# EAGLE design SparkFun_MicroMod_Function_ADIN1110 (EAGLE 9.6.2)
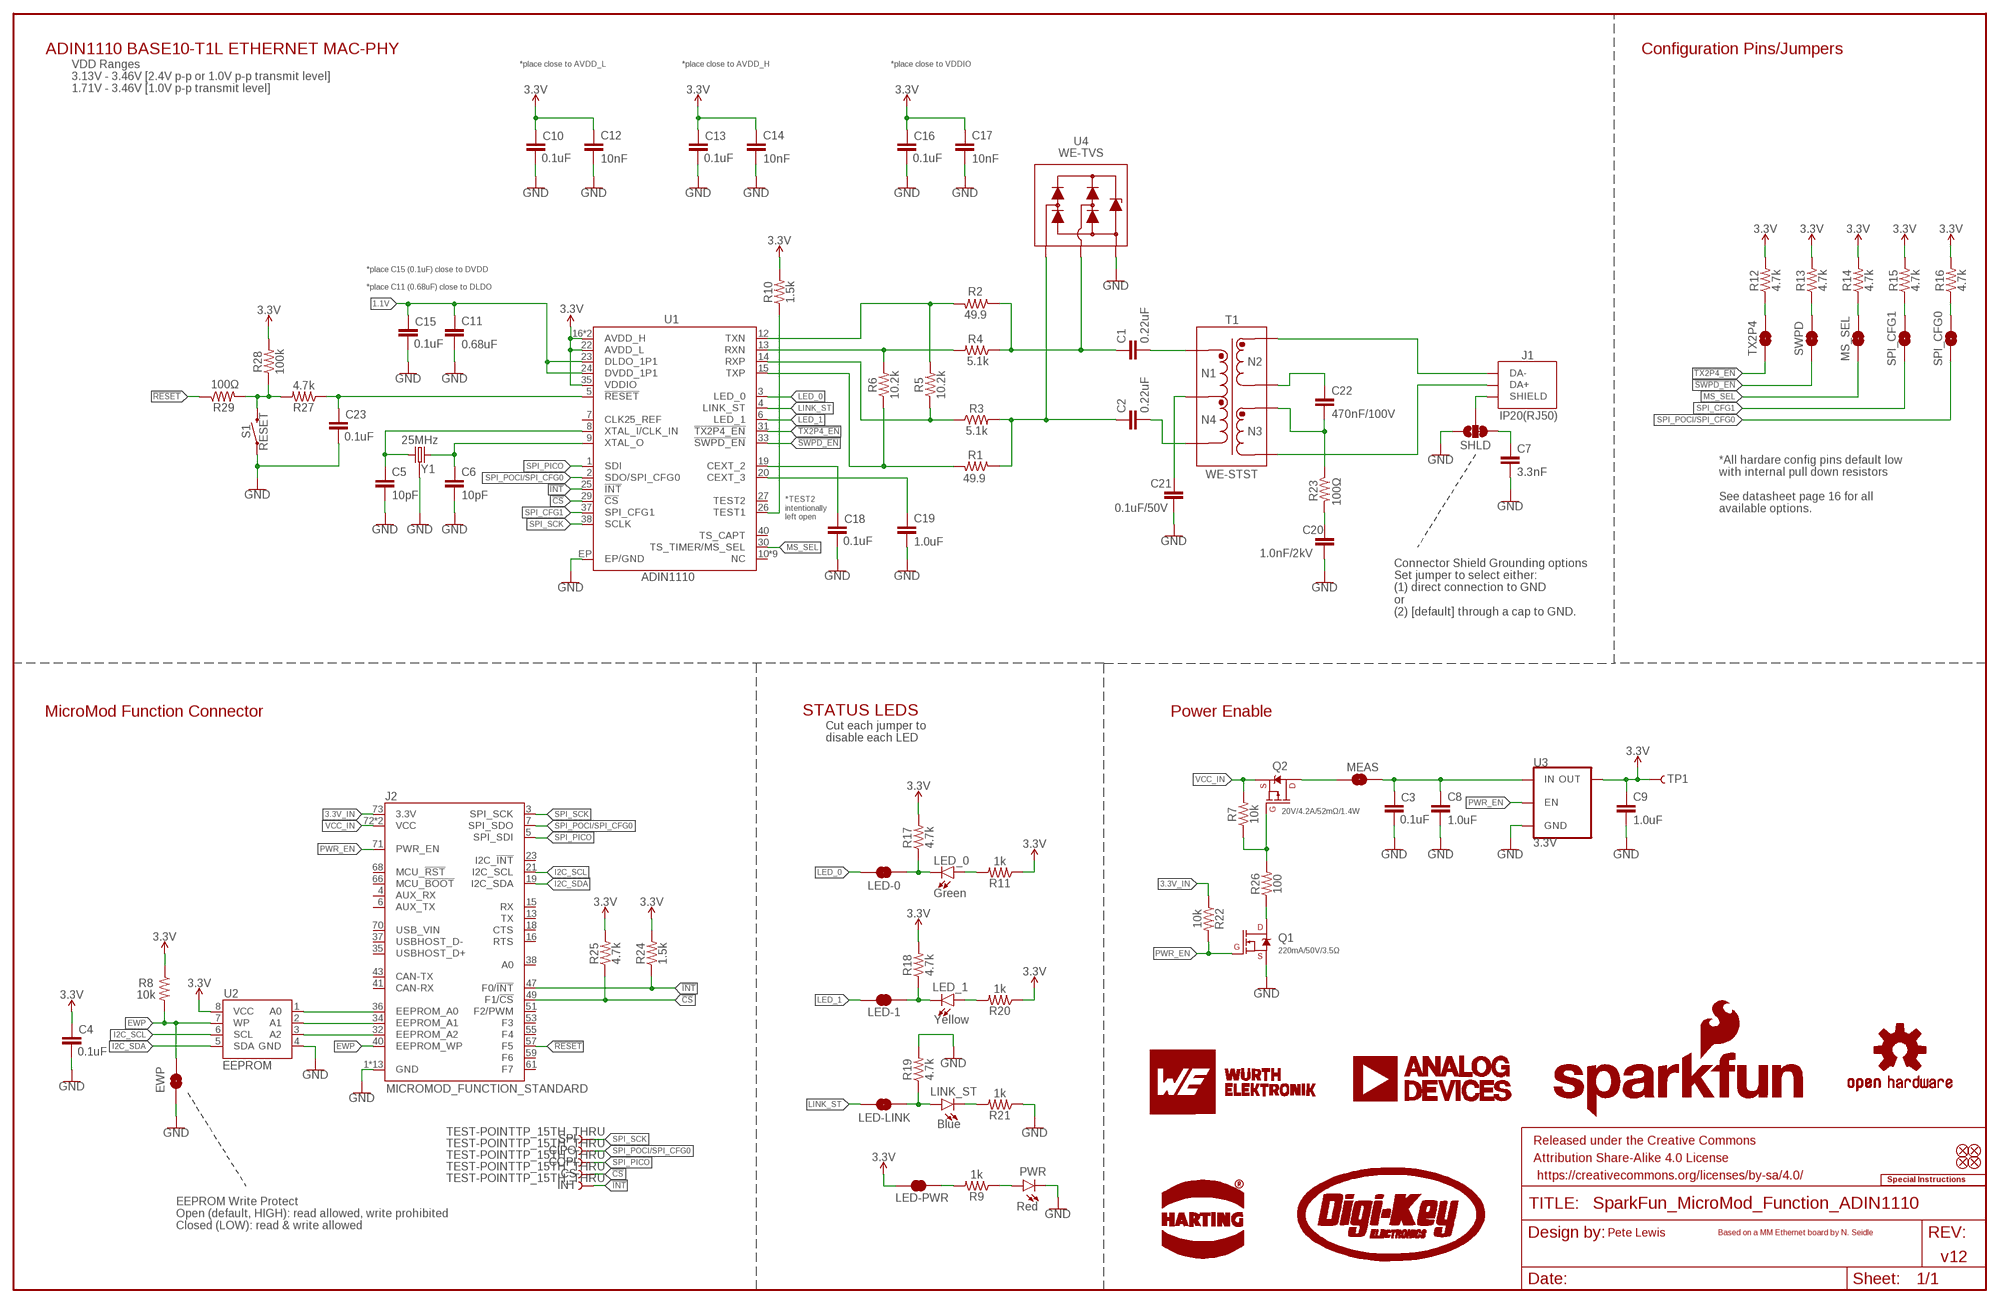
[diagram p0: schematic, sheet 1]

## Parts
C1  0.22uF  0.22UF-0603-50V-10%  [0603]
C2  0.22uF  0.22UF-0603-50V-10%  [0603]
C3  0.1uF  0.1UF-0603-25V-10%-X7R-WE  [0603]
C4  0.1uF  0.1UF-0603-25V-10%-X7R-WE  [0603]
C5  10pF  10PF-0603-50V-5%-C0G-WE  [0603]
C6  10pF  10PF-0603-50V-5%-C0G-WE  [0603]
C7  3.3nF  3.3NF-0603-100V-10%-WE  [0603]
C8  1.0uF  1.0UF-0603-16V-10%-X7R-WE  [0603]
C9  1.0uF  1.0UF-0603-16V-10%-X7R-WE  [0603]
C10  0.1uF  0.1UF-0402T-16V-10%-X7R-WE  [0402-TIGHT]
C11  0.68uF  0.68UF-0603-16V-10%-X7R-WE  [0603]
C12  10nF  10NF-0402T-25V-10%-X7R-WE  [0402-TIGHT]
C13  0.1uF  0.1UF-0402T-16V-10%-X7R-WE  [0402-TIGHT]
C14  10nF  10NF-0402T-25V-10%-X7R-WE  [0402-TIGHT]
C15  0.1uF  0.1UF-0402T-16V-10%-X7R-WE  [0402-TIGHT]
C16  0.1uF  0.1UF-0402T-16V-10%-X7R-WE  [0402-TIGHT]
C17  10nF  10NF-0402T-25V-10%-X7R-WE  [0402-TIGHT]
C18  0.1uF  0.1UF-0402T-16V-10%-X7R-WE  [0402-TIGHT]
C19  1.0uF  1.0UF-0402T-16V-10%  [0402-TIGHT]
C20  1.0nF/2kV  1.0NF/1000PF-1206-2KV-10%-X7R-WORTH-ELEKRONIK  [1206]
C21  0.1uF/50V  0.1UF-0603-50V-10%-X7R-WE  [0603]
C22  470nF/100V  470NF-0805-100V-10%-X7S  [0805]
C23  0.1uF  0.1UF-0402T-16V-10%-X7R-WE  [0402-TIGHT]
CIPO  TEST-POINTTP_15TH_THRU  [TP_15TH]
COPI  TEST-POINTTP_15TH_THRU  [TP_15TH]
CS  TEST-POINTTP_15TH_THRU  [TP_15TH]
EWP  JUMPER-SMT_2_NO_SILK  [SMT-JUMPER_2_NO_SILK]
FD1  FIDUCIALUFIDUCIAL  [FIDUCIAL-MICRO]
FD2  FIDUCIALUFIDUCIAL  [FIDUCIAL-MICRO]
FD3  FIDUCIALUFIDUCIAL  [FIDUCIAL-MICRO]
FD4  FIDUCIALUFIDUCIAL  [FIDUCIAL-MICRO]
FRAME1  FRAME-LEDGER  [CREATIVE_COMMONS]
INT  TEST-POINTTP_15TH_THRU  [TP_15TH]
J1  IP20(RJ50)  T1_INDUSTRIAL_JACK_AH_IP20  [T1_INDUSTRIAL_JACK_AH_IP20]
J2  MICROMOD_FUNCTION_STANDARD  [M.2-CARD-E-22_FUNCTION_STANDARD]
LED-0  JUMPER-SMT_2_NC_TRACE_SILK  [SMT-JUMPER_2_NC_TRACE_SILK]
LED-1  JUMPER-SMT_2_NC_TRACE_SILK  [SMT-JUMPER_2_NC_TRACE_SILK]
LED-LINK  JUMPER-SMT_2_NC_TRACE_SILK  [SMT-JUMPER_2_NC_TRACE_SILK]
LED-PWR  JUMPER-SMT_2_NC_TRACE_SILK  [SMT-JUMPER_2_NC_TRACE_SILK]
LED_0  Green  LED-GREEN-0603-WE  [LED-0603]
LED_1  Yellow  LED-YELLOW-0603-WE  [LED-0603]
LINK_ST  Blue  LED-BLUE-0603-WE  [LED-0603]
LOGO1  SFE_LOGO_NAME_FLAME.1_INCH  [SFE_LOGO_NAME_FLAME_.1]
LOGO2  SPECIAL_INSTRUCTIONS-ORDERING  [ORDERING_INSTRUCTIONS]
LOGO3  OSHW-LOGOMINI  [OSHW-LOGO-MINI]
MEAS  JUMPER-COMBO_2_NC_TRACE  [COMBO-JUMPER_2_NC_TRACE]
MS_SEL  JUMPER-SMT_2_NO_SILK  [SMT-JUMPER_2_NO_SILK]
PWR  Red  LED-RED-0603-WE  [LED-0603]
Q1  220mA/50V/3.5Ω  MOSFET-NCH-BSS138  [SOT23-3]
Q2  20V/4.2A/52mΩ/1.4W  MOSFET_PCH-DMG2305UX-7  [SOT23-3]
R1  49.9  49.9OHM-0603-1/10W-1%  [0603]
R2  49.9  49.9OHM-0603-1/10W-1%  [0603]
R3  5.1k  5.1KOHM-0402T-1/16W-1%  [0402-TIGHT]
R4  5.1k  5.1KOHM-0402T-1/16W-1%  [0402-TIGHT]
R5  10.2k  10.2KOHM-0402-1/16W-1%  [0402-TIGHT]
R6  10.2k  10.2KOHM-0402-1/16W-1%  [0402-TIGHT]
R7  10k  10KOHM-0603-1/10W-1%  [0603]
R8  10k  10KOHM-0603-1/10W-1%  [0603]
R9  1k  1KOHM-0402T-1/16W-1%  [0402-TIGHT]
R10  1.5k  1.5KOHM-0603-1/10W-1%  [0603]
R11  1k  1KOHM-0402T-1/16W-1%  [0402-TIGHT]
R12  4.7k  4.7KOHM-0402T-1/16W-1%  [0402-TIGHT]
R13  4.7k  4.7KOHM-0402T-1/16W-1%  [0402-TIGHT]
R14  4.7k  4.7KOHM-0402T-1/16W-1%  [0402-TIGHT]
R15  4.7k  4.7KOHM-0402T-1/16W-1%  [0402-TIGHT]
R16  4.7k  4.7KOHM-0402T-1/16W-1%  [0402-TIGHT]
R17  4.7k  4.7KOHM-0402T-1/16W-1%  [0402-TIGHT]
R18  4.7k  4.7KOHM-0402T-1/16W-1%  [0402-TIGHT]
R19  4.7k  4.7KOHM-0402T-1/16W-1%  [0402-TIGHT]
R20  1k  1KOHM-0402T-1/16W-1%  [0402-TIGHT]
R21  1k  1KOHM-0402T-1/16W-1%  [0402-TIGHT]
R22  10k  10KOHM-0603-1/10W-1%  [0603]
R23  100Ω  100OHM-0603-1/10W-1%  [0603]
R24  1.5k  1.5KOHM-0603-1/10W-1%  [0603]
R25  4.7k  4.7KOHM-0402T-1/16W-1%  [0402-TIGHT]
R26  100  100OHM-0603-1/10W-1%  [0603]
R27  4.7k  4.7KOHM-0603-1/10W-1%  [0603]
R28  100k  100KOHM-0402T-1/16W-1%  [0402-TIGHT]
R29  100Ω  100OHM-0603-1/10W-1%  [0603]
S1  RESET  MOMENTARY-SWITCH-SPST-SMD-5.2MM-TALL  [TACTILE_SWITCH_SMD_5.2MM]
SHLD  JUMPER-SMT_3_1-NC_TRACE_SILK  [SMT-JUMPER_3_1-NC_TRACE_SILK]
SPI  TEST-POINTTP_15TH_THRU  [TP_15TH]
SPI_CFG0  JUMPER-SMT_2_NO_SILK  [SMT-JUMPER_2_NO_SILK]
SPI_CFG1  JUMPER-SMT_2_NO_SILK  [SMT-JUMPER_2_NO_SILK]
SWPD  JUMPER-SMT_2_NO_SILK  [SMT-JUMPER_2_NO_SILK]
T1  WE-STST  WE_STST_TRANSFORMER_1:1_SMD_74930030_3.2X4.7MM  [WE_STST_TRANSFORMER_1:1_SMD_3.2X4.7MM_74930030]
TP1  TEST-POINT3X4  [PAD.03X.04]
TX2P4  JUMPER-SMT_2_NO_SILK  [SMT-JUMPER_2_NO_SILK]
U1  ADIN1110  [LFCSP-40]
U2  EEPROM  EEPROM-I2C512K  [SO08]
U3  3.3V  V_REG_AP2112K-3.3V  [SOT23-5]
U4  WE-TVS  WE-TVS_DIODE_ARRAY_824012823_1.0X1.2MM  [WE_TVS_1.0X1.2MM]
U$2  HARTING_LOGO  [HARTING_LOGO_9MM]
U$5  DIGIKEY_LOGO  [DIGIKEY_LOGO]
U$19  WURTH_LOGO  [WURTH_LOGO_9MM]
U$33  ANALOG_DEVICES_LOGO  [ANALOG_DEVICE_LOGO_9MM]
Y1  25MHz  CRYSTAL-25MHZ-WE-SMD-2.0X1.6MM-WE  [CRYSTAL-SMD-2.0X1.6MM-WE]

## Nets
1.1V: C11.1 C15.1 U1.23(DLDO_1P1) U1.24(DVDD_1P1)
3.3V: C4.1 C9.1 C10.1 C12.1 C13.1 C14.1 C16.1 C17.1 LED-PWR.2 R8.1 R10.2 R11.1 R12.2 R13.2 R14.2 R15.2 R16.2 R17.2 R18.2 R20.1 R24.2 R25.2 R28.2 TP1.1 U1.16(AVDD_H) U1.17(AVDD_H) U1.22(AVDD_L) U1.35(VDDIO) U2.8(VCC) U3.5(OUT)
3.3V_IN: J2.73(3.3V) R22.1
!CS!: CS.1 J2.49(F1/!CS!) R25.1 U1.29(!CS!)
!INT!: INT.1 J2.47(F0/!INT!) R24.1 U1.25(!INT!)
!RESET!: J2.57(F5) R29.1
!SWPD_EN!: SWPD.1 U1.33(!SWPD_EN!)
!TX2P4_EN!: TX2P4.1 U1.31(!TX2P4_EN!)
A0: J2.36(EEPROM_A0) U2.1(A0)
A1: J2.34(EEPROM_A1) U2.2(A1)
A2: J2.32(EEPROM_A2) U2.3(A2)
DA+: J1.1(DA+) T1.7
DA-: J1.2(DA-) T1.6
EWP: EWP.2 J2.40(EEPROM_WP) R8.2 U2.7(WP)
GND: C3.2 C4.2 C5.2 C6.2 C7.2 C8.2 C9.2 C10.2 C11.2 C12.2 C13.2 C14.2 C15.2 C16.2 C17.2 C18.2 C19.2 C20.2 C21.2 C23.2 EWP.1 J2.1(GND) J2.2(GND) J2.8(GND) J2.33(GND) J2.39(GND) J2.45(GND) J2.75(GND) J2.GND1(GND) J2.GND2(GND) J2.GND3(GND) J2.GND4(GND) J2.GND5(GND) J2.GND6(GND) PWR.C Q1.2(S) R19.2 R21.1 S1.1 SHLD.1 U1.EP(EP/GND) U2.4(GND) U3.2(GND) U4.3 Y1.2(GND) Y1.4(GND)
I2C_SCL: J2.21(I2C_SCL) U2.6(SCL)
I2C_SDA: J2.19(I2C_SDA) U2.5(SDA)
LED_0: LED-0.2 U1.3(LED_0)
LED_1: LED-1.2 U1.6(LED_1)
LINK_ST: LED-LINK.2 U1.4(LINK_ST)
MS_SEL: MS_SEL.1 U1.30(TS_TIMER/MS_SEL)
N$1: MEAS.1 MEAS.3 Q2.3(D)
N$2: C3.1 C8.1 MEAS.2 MEAS.4 U3.1(IN)
N$3: C21.1 T1.5
N$4: C22.1 T1.4
N$5: LED-LINK.1 LINK_ST.A R19.1
N$6: LED-1.1 LED_1.C R18.1
N$7: C22.2 R23.1 T1.3
N$8: C20.1 R23.2
N$9: LED-0.1 LED_0.C R17.1
N$10: Q1.3(D) R26.1
N$11: Q2.1(G) R7.1 R26.2
N$12: C5.1 U1.8(XTAL_I/CLK_IN) Y1.1
N$13: C23.1 R27.1 U1.5(!RESET!)
N$14: C6.1 U1.9(XTAL_O) Y1.3
N$15: R27.2 R28.1 R29.2 S1.3
N$18: R10.1 U1.26(TEST1)
N$19: LED-PWR.1 R9.2
N$20: PWR.A R9.1
N$21: C18.1 U1.19(CEXT_2)
N$22: C19.1 U1.20(CEXT_3)
N$23: LED_0.A R11.2
N$24: C1.1 R2.1 R4.1 U4.2 U4.5
N$25: MS_SEL.2 R14.1
N$26: R13.1 SWPD.2
N$27: R12.1 TX2P4.2
N$28: R16.1 SPI_CFG0.2
N$29: R15.1 SPI_CFG1.2
N$30: LED_1.A R20.2
N$31: C2.1 R1.1 R3.2 U4.1 U4.6
N$32: C1.2 T1.1
N$33: LINK_ST.C R21.2
N$34: C2.2 T1.2
N$35: R4.2 R6.2 U1.13(RXN)
N$36: R3.1 R5.1 U1.14(RXP)
N$37: R1.2 R6.1 U1.15(TXP)
N$38: R2.2 R5.2 U1.12(TXN)
N$41: C7.1 SHLD.3
N$43: J1.S1(SHIELD) J1.S2(SHIELD) J1.S3(SHIELD) J1.S4(SHIELD) SHLD.2
PWR_EN: J2.71(PWR_EN) Q1.1(G) R22.2 U3.3(EN)
SPI_CFG1: SPI_CFG1.1 U1.37(SPI_CFG1)
SPI_PICO: COPI.1 J2.5(SPI_SDI) U1.1(SDI)
SPI_POCI/SPI_CFG0: CIPO.1 J2.7(SPI_SDO) SPI_CFG0.1 U1.2(SDO/SPI_CFG0)
SPI_SCK: J2.3(SPI_SCK) SPI.1 U1.38(SCLK)
VCC_IN: J2.72(VCC) J2.74(VCC) Q2.2(S) R7.2
Unconnected: J2.4(AUX_RX) J2.6(AUX_TX) J2.13(TX) J2.15(RX) J2.16(RTS) J2.18(CTS) J2.23(I2C_!INT!) J2.35(USBHOST_D+) J2.37(USBHOST_D-) J2.38(A0) J2.41(CAN-RX) J2.43(CAN-TX) J2.51(F2/PWM) J2.53(F3) J2.55(F4) J2.59(F6) J2.61(F7) J2.66(MCU_!BOOT!) J2.68(MCU_!RST!) J2.70(USB_VIN) U1.7(CLK25_REF) U1.10(NC) U1.11(NC) U1.18(NC) U1.21(NC) U1.27(TEST2) U1.28(NC) U1.32(NC) U1.34(NC) U1.36(NC) U1.39(NC) U1.40(TS_CAPT)

## Notes on the sheet
- ADIN1110 BASE10-T1L ETHERNET MAC-PHY | Configuration Pins/Jumpers
- VDD Ranges
  3.13V - 3.46V [2.4V p-p or 1.0V p-p transmit level]
  1.71V - 3.46V [1.0V p-p transmit level]
- *place close to AVDD_L | *place close to AVDD_H | *place close to VDDIO
- *place C15 (0.1uF) close to DVDD
  
  *place C11 (0.68uF) close to DLDO
- *TEST2 
  intentionally 
  left open
- *All hardare config pins default low 
  with internal pull down resistors
  
  See datasheet page 16 for all
  available options.
- Connector Shield Grounding options
  Set jumper to select either:
  (1) direct connection to GND
  or
  (2) [default] through a cap to GND.
- MicroMod Function Connector | STATUS LEDS | Power Enable
- Cut each jumper to 
  disable each LED
- EEPROM Write Protect
  Open (default, HIGH): read allowed, write prohibited
  Closed (LOW): read & write allowed
- Pete Lewis | Based on a MM Ethernet board by N. Seidle
- v12

## Library data of the parts
C1 C2 = SparkFun-Capacitors:0.22UF: 0.22µF ceramic capacitors A capacitor is a passive two-terminal electrical component used to store electrical energy temporarily in an electric field.; PROD_ID: CAP-15456
C3 C4 = SparkFun-Capacitors:0.1UF: 0.1µF ceramic capacitors A capacitor is a passive two-terminal electrical component used to store electrical energy temporarily in an electric field.; PROD_ID: CAP-16503
C5 C6 = SparkFun-Capacitors:10PF: 10pF ceramic capacitors A capacitor is a passive two-terminal electrical component used to store electrical energy temporarily in an electric field.; PROD_ID: CAP-16506
C7 = SparkFun-Capacitors:3.3NF: 3.3nF ceramic capacitors A capacitor is a passive two-terminal electrical component used to store electrical energy temporarily in an electric field.; PROD_ID: CAP-16505
C8 C9 = SparkFun-Capacitors:1.0UF: 1µF ceramic capacitors A capacitor is a passive two-terminal electrical component used to store electrical energy temporarily in an electric field.; PROD_ID: CAP-16504
C10 C13 C15 C16 C18 C23 = SparkFun-Capacitors:0.1UF: 0.1µF ceramic capacitors A capacitor is a passive two-terminal electrical component used to store electrical energy temporarily in an electric field.; PROD_ID: CAP-16507
C11 = SparkFun-Capacitors:0.68UF: 0.68µF ceramic capacitors A capacitor is a passive two-terminal electrical component used to store electrical energy temporarily in an electric field.; PROD_ID: CAP-16639
C12 C14 C17 = SparkFun-Capacitors:10NF: 0.01uF/10nF/10,000pF ceramic capacitors A capacitor is a passive two-terminal electrical component used to store electrical energy temporarily in an electric field. CAP-09321; PROD_ID: CAP-16508
C19 = SparkFun-Capacitors:1.0UF: 1µF ceramic capacitors A capacitor is a passive two-terminal electrical component used to store electrical energy temporarily in an electric field.; PROD_ID: CAP-12417
C20 = SparkFun-Capacitors:1.0NF/1000PF: 1nF/1,000pF ceramic capacitors A capacitor is a passive two-terminal electrical component used to store electrical energy temporarily in an electric field.; PROD_ID: CAP-16430; VALUE: 1.0nF
C21 = SparkFun-Capacitors:0.1UF: 0.1µF ceramic capacitors A capacitor is a passive two-terminal electrical component used to store electrical energy temporarily in an electric field.; PROD_ID: CAP-16523; VALUE: 0.1uF
C22 = SparkFun-Capacitors:470NF: 0.47uF/470nF ceramic capacitors A capacitor is a passive two-terminal electrical component used to store electrical energy temporarily in an electric field.; PROD_ID: CAP-16570; VALUE: 470nF
CIPO COPI CS INT SPI TP1 = SparkFun-Connectors:TEST-POINT: SparkFun Test Points Bare copper test points for troubleshooting or In-Circuit-Testing. These are used by our Production team for verifying production board runs using pogo-pins on test beds. SparkFun Products: SparkFun LSM9DS1 Breakout <https://www.sparkfun.com/products/13284> SparkFun PSOC <https://www.sparkfun.com/products/13714> SparkFun Load Cell Amplifier <https://www.sparkfun.com/products/13879>
EWP MS_SEL SPI_CFG0 SPI_CFG1 SWPD TX2P4 = SparkFun-Jumpers:JUMPER-SMT_2_NO: Normally open jumper This jumper has two pads in close proximity to each other. Apply solder to close the connection. Round pads are easier to solder for beginners, but are a lot larger. SparkFun Product that uses the round pads: SparkFun EL Sequencer <https://www.sparkfun.com/products/12781>
FD1-FD4 = SparkFun-Aesthetics:FIDUCIAL: Fiducial Alignment Points Point-of-reference for pick-and-place machines and other optical instruments.
FRAME1 = SparkFun-Aesthetics:FRAME-LEDGER: Schematic Frame - Ledger Standard 11x14 US Ledger frame
J1 = ADIN1110:T1_INDUSTRIAL_JACK_AH_IP20; PROD_ID: CONN-16501
J2 = SparkFun-MicroMod:MICROMOD_FUNCTION: MicroMod Connector Description: A card edge connector and mating PCB connector to allow various MicroMod Processor Boards to be coupled with various carrier boards of different capabilities. Based on the M.2 standard.
LED-0 LED-1 LED-LINK LED-PWR = SparkFun-Jumpers:JUMPER-SMT_2_NC_TRACE: Normally closed trace jumper This jumper has a trace between two pads so it's normally closed (NC). Use a razor knife to open the connection. For best results follow the IPC guidelines for cutting traces: Cutout at least 0.063 mm (0.005 in). Remove all loose material to clean up the cut area. Seal the cut with an approved epoxy. Reapply solder to reclose the connection.
LED_0 = SparkFun-LED:LED-GREEN: Green SMD LED Used in manufacturing of various products at SparkFun Packages: 0603 - SMD 0603 package [Product Link] <http://www.futureelectronics.com/en/technologies/semiconductors/optoelectronics/leds/Pages/9894312-LTST-C190GKT.aspx?CrossPart=HSMG-C190&IM=0> LilyPad 1206 - SMD1206 LilyPad package [Product Link] <http://www.futureelectronics.com/en/Technologies/Product.aspx?ProductID=IN150NGHARVATEKCORPORATION2049943&IM=0> 1206 - SMD1206 package [Product Link] <http://www.futureelectronics.com/en/technologies/semiconductors/optoelectronics/leds/Pages/8315665-LTST-C150KGKT.aspx?IM=0> 1206 Bottom Mount -SMD 1206 Bottom Mount [Product Link] <http://www.digikey.com/product-detail/en/lite-on-inc/LTST-C230KGKT/160-1456-1-ND/386854> SparkFun Products: Pro Mini 328 -5V <https://www.sparkfun.com/products/821> RedBoard <https://www.sparkfun.com/products/12757> MP3 Trigger <https://www.sparkfun.com/products/13720> Makey Makey <https://www.sparkfun.com/products/11076>; PROD_ID: DIO-16512
LED_1 = SparkFun-LED:LED-YELLOW: Yellow SMD LED Used in manufacturing several products at SparkFun. Packages: 0603 - SMD 0603 package[Product Link] <http://www.kingbrightusa.com/product.asp?catalog_name=LED&product_id=APT1608SYCK> 0603 -SMART - SMART SMD 0603 package (more efficient/more expensive) [Product Link] <http://www.osram-os.com/osram_os/en/products/product-catalog/led-light-emitting-diodes/smartled-0603/ly-l29k/index.jsp> LilyPad - SMD1206 package[Product Datasheet] <https://www.sparkfun.com/datasheets/DevTools/LilyPad/Q150YUS4.pdf> SparkFun Products: Blynk Board <https://www.sparkfun.com/products/13794> IOIO-OTG <https://www.sparkfun.com/products/13613> XBee Explorer Serial <https://www.sparkfun.com/products/13225>; PROD_ID: DIO-16514
LINK_ST = SparkFun-LED:LED-BLUE: Blue SMD LED Used in manufacturing of various products at SparkFun Packages: 0603 - SMD 0603 package [Product Link] <http://www.digikey.com/product-detail/en/SMLE12BC7TT86/511-1589-2-ND/1641808> 1206 - SMD1206 package [Product Link] <http://www.digikey.com/product-detail/en/lite-on-inc/LTST-C150TBKT/160-1643-1-ND/573584> SparkFun Products: ESP8266 Thing-Dev Board <https://www.sparkfun.com/products/13711> RedBoard <https://www.sparkfun.com/products/12757>; PROD_ID: DIO-16513
LOGO1 = SparkFun-Aesthetics:SFE_LOGO_NAME_FLAME: SparkFun Font Logo w/ Flame This is the SparkFun full logo. The logo on the schematic will always be the same size; the package variant is the height of the flame part of the logo. Default layer for the logo on the board is tSilk.
LOGO2 = SparkFun-Aesthetics:SPECIAL_INSTRUCTIONS: Special Ordering/Production Instructions Alert Symbol for special PCB ordering instructions or unique production process warnings. Ordering Instructions Production Instructions Types of information that should be added to box: Copper weight Soldermask color Silk color PCB thickness Number of layers PCB Standard: 1.6mm FR4 1 oz copper immersion silver plating red soldermask white silkscreen Types of information that should be added to box: Special wash requirements Depaneling instructions Humidification Glue curing Default text settings: 0.07 inch 9% ratio 50% line distance
LOGO3 = SparkFun-Aesthetics:OSHW-LOGO: Open-Source Hardware (OSHW) Logo This logo indicates the piece of hardware it is found on incorporates a OSHW license and/or adheres to the definition of open source hardware found here: http://freedomdefined.org/OSHW
MEAS = SparkFun-Jumpers:JUMPER-COMBO_2_NC_TRACE
PWR = SparkFun-LED:LED-RED: Red SMD LED Used in manufacturing of most products at SparkFun Packages: 0603 - SMD 0603 package [Product Link] <http://docs.avagotech.com/docs/AV02-0551EN> 0603 SMART - SMD 0603 SMART package ( more efficient and expensive)[Product Link] <http://www.osram-os.com/Graphics/XPic2/00077099_0.pdf> 1206 - SMD1206 package [Product Link] <https://www.sparkfun.com/datasheets/DevTools/LilyPad/Q150OVS4.pdff> SparkFun Products: Pro Mini 328 -5V <https://www.sparkfun.com/products/821> RedBoard <https://www.sparkfun.com/products/12757> IOIO-OTG <https://www.sparkfun.com/products/13613>; PROD_ID: DIO-16511
Q1 = SparkFun-DiscreteSemi:MOSFET-NCH: N-channel MOSFETs Voltage controlled devices that allow control of high current outputs. SparkFun Products: SparkFun OpenScale <https://www.sparkfun.com/products/13261> SparkFun Digital Sandbox <https://www.sparkfun.com/products/12651> SparkFun Monster Moto Shield <https://www.sparkfun.com/products/10182> SparkFun MOSFET Power Controller <https://www.sparkfun.com/products/11214>; PROD_ID: TRANS-00830
Q2 = SparkFun-DiscreteSemi:MOSFET_PCH: P-channel MOSFETs Voltage controlled devices that allow control of high current outputs. SparkFun Products: SparkFun ESP32 Thing <https://www.sparkfun.com/products/13907> SparkFun ESP8266 Thing <https://www.sparkfun.com/products/13231> SparkFun Pi Servo HAT V2 <https://www.sparkfun.com/products/15316> DMG2305UX-7 (20V/4.2A/SOT23-3); PROD_ID: TRANS-14388
R1 R2 = SparkFun-Resistors:49.9OHM: 49.9Ω resistor A resistor is a passive two-terminal electrical component that implements electrical resistance as a circuit element. Resistors act to reduce current flow, and, at the same time, act to lower voltage levels within circuits. - Wikipedia; PROD_ID: RES-16237
R3 R4 = SparkFun-Resistors:5.1KOHM; PROD_ID: RES-14340
R5 R6 = SparkFun-Resistors:10.2KOHM: 10.2kΩ resistor A resistor is a passive two-terminal electrical component that implements electrical resistance as a circuit element. Resistors act to reduce current flow, and, at the same time, act to lower voltage levels within circuits. - Wikipedia; PROD_ID: RES-16559
R7 R8 R22 = SparkFun-Resistors:10KOHM: 10kΩ resistor A resistor is a passive two-terminal electrical component that implements electrical resistance as a circuit element. Resistors act to reduce current flow, and, at the same time, act to lower voltage levels within circuits. - Wikipedia; PROD_ID: RES-00824
R9 R11 R20 R21 = SparkFun-Resistors:1KOHM: 1kΩ resistor A resistor is a passive two-terminal electrical component that implements electrical resistance as a circuit element. Resistors act to reduce current flow, and, at the same time, act to lower voltage levels within circuits. - Wikipedia; PROD_ID: RES-14342
R10 R24 = SparkFun-Resistors:1.5KOHM: 1.5kΩ resistor A resistor is a passive two-terminal electrical component that implements electrical resistance as a circuit element. Resistors act to reduce current flow, and, at the same time, act to lower voltage levels within circuits. - Wikipedia; PROD_ID: RES-08306
R12-R19 R25 = SparkFun-Resistors:4.7KOHM: 4.7kΩ resistor A resistor is a passive two-terminal electrical component that implements electrical resistance as a circuit element. Resistors act to reduce current flow, and, at the same time, act to lower voltage levels within circuits. - Wikipedia; PROD_ID: RES-15343
R23 R29 = SparkFun-Resistors:100OHM: 100Ω resistor A resistor is a passive two-terminal electrical component that implements electrical resistance as a circuit element. Resistors act to reduce current flow, and, at the same time, act to lower voltage levels within circuits. - Wikipedia; PROD_ID: RES-07863; VALUE: 100
R26 = SparkFun-Resistors:100OHM: 100Ω resistor A resistor is a passive two-terminal electrical component that implements electrical resistance as a circuit element. Resistors act to reduce current flow, and, at the same time, act to lower voltage levels within circuits. - Wikipedia; PROD_ID: RES-07863
R27 = SparkFun-Resistors:4.7KOHM: 4.7kΩ resistor A resistor is a passive two-terminal electrical component that implements electrical resistance as a circuit element. Resistors act to reduce current flow, and, at the same time, act to lower voltage levels within circuits. - Wikipedia; PROD_ID: RES-07857
R28 = SparkFun-Resistors:100KOHM: 100kΩ resistor A resistor is a passive two-terminal electrical component that implements electrical resistance as a circuit element. Resistors act to reduce current flow, and, at the same time, act to lower voltage levels within circuits. - Wikipedia; PROD_ID: RES-13495
S1 = SparkFun-Switches:MOMENTARY-SWITCH-SPST: Momentary Switch (Pushbutton) - SPST Normally-open (NO) SPST momentary switches (buttons, pushbuttons). Variants PTH-12MM - 12mm square, through-hole Momentary Pushbutton Switch - 12mm Square <https://www.sparkfun.com/products/9190> (COM-09190) PTH-6.0MM, PTH-6.0MM-KIT - 6.0mm square, through-hole Mini Pushbutton Switch <https://www.sparkfun.com/products/97> (COM-00097) KIT package intended for soldering kit's - only one side of pads' copper is exposed. PTH-RIGHT-ANGLE-KIT - Right-angle, through-hole Right Angle Tactile Button <https://www.sparkfun.com/products/10791> - Used on SparkFun BigTime Watch Kit <https://www.sparkfun.com/products/11734> SMD-12MM - 12mm square, surface-mount Tactile Button - SMD (12mm) <https://www.sparkfun.com/products/12993> (COM-12993) Used on SparkFun PicoBoard <https://www.sparkfun.com/products/11888> SMD-4.5MM - 4.5mm Square Trackball Switch Used on SparkFun Blackberry Trackballer Breakout <https://www.sparkfun.com/products/13169> SMD-4.6MMX2.8MM - 4.60mm x 2.80mm, surface mount Used on SparkFun Pro Micro - RP2040 <https://www.sparkfun.com/products/17717> SMD-5.2MM, SMD-5.2-REDUNDANT - 5.2mm square, surface-mount Mini Pushbutton Switch - SMD <https://www.sparkfun.com/products/8720> (COM-08720) Used on Arduino Pro Mini <https://www.sparkfun.com/products/11114> REDUNDANT package connects both switch circuits together SMD-6.0X3.5MM - 6.0 x 3.5mm, surface mount Momentary Reset Switch SMD <https://www.sparkfun.com/products/8229> (COM-08229) SMD-6.2MM-TALL - 6.2mm square, surface mount Tactile Button - SMD (6mm) <https://www.sparkfun.com/products/12992> Used on SparkFun Digital Sandbox <https://www.sparkfun.com/products/12651> SMD-RIGHT-ANGLE - Right-angle, surface mount Used on SparkFun Block for Intel® Edison - Arduino <https://www.sparkfun.com/products/13036>; PROD_ID: SWCH-14139
SHLD = SparkFun-Jumpers:JUMPER-SMT_3_1-NC_TRACE: Normally closed trace jumper (1 of 2 connections) This jumper has a trace between two pads so it's normally closed (NC). The other connection is normally open (NO). Use a razor knife to open the connection. For best results follow the IPC guidelines for cutting traces: Cutout at least 0.063 mm (0.005 in). Remove all loose material to clean up the cut area. Seal the cut with an approved epoxy. Reapply solder to reclose the connection, or to close the NO connection.
T1 = ADIN1110:WE_STST_TRANSFORMER_1:1_SMD_74930030: WE-STST Super Tiny Signal Transformer with PoE Wurth Electronics Part No: 74930030; PROD_ID: COMP-16426
U1 = ADIN1110:ADIN1110: The ADIN1110 is an ultra low power, single port, 10BASE-T1L transceiver design for industrial Ethernet applications and is compliant with the IEEE® 802.3cg-2019™ Ethernet standard for long reach, 10 Mbps single pair Ethernet (SPE).; PROD_ID: IC-16335
U2 = SparkFun-IC-Memory:EEPROM-I2C: I2C EEPROMs, 24LC256 and others 24LC256 Series 256 kb I2C 2 Wire (32 k x 8 Bit) 2.5 V Serial EEPROM SMD - SOIC-8 Datasheet SparkFun Products SparkFun UDB5 - PIC UAV Development Board <https://www.sparkfun.com/products/11703> (GPS-11703); PROD_ID: IC-14645
U3 = SparkFun-IC-Power:V_REG_AP2112: AP2112 - 600mA CMOS LDO Regulator w/ Enable The AP2112 is CMOS process low dropout linear regulator with enable function, the regulator delivers a guaranteed 600mA (min.) continuous load current. Features Output Voltage Accuracy: ±1.5% Output Current: 600mA (Min.) Foldback Short Current Protection: 50mA Enable Function to Turn ON/OFF VOUT Low Dropout Voltage (3.3V): 250mV (Typ.) @IOUT=600mA Excellent Load Regulation: 0.2%/A (Typ.) Excellent Line Regulation: 0.02%/V (Typ.) Low Quiescent Current: 55μA (Typ.) Low Standby Current: 0.01μA (Typ.) Low Output Noise: 50μVRMS PSRR: 100Hz -65dB, 1kHz -65dB OTSD Protection Stable with 1.0μF Flexible Cap: Ceramic, Tantalum and Aluminum Electrolytic Operation Temperature Range: -40°C to 85°C ESD: MM 400V, HBM 4000V; PROD_ID: VREG-12457
U4 = ADIN1110:WE-TVS_DIODE_ARRAY_824012823: WE-TVS TVS Diode – Super Speed Series; PROD_ID: DIO-16429
U$2 = temp_logos:HARTING_LOGO
U$5 = temp_logos:DIGIKEY_LOGO
U$19 = temp_logos:WURTH_LOGO
U$33 = temp_logos:ANALOG_DEVICES_LOGO
Y1 = SparkFun-Clocks:CRYSTAL-25MHZ-WE: 25MHz Crystal; PROD_ID: XTAL-16515

## Net classes
0 default: width 0 mm, drill 0 mm
1 vcc: width 0 mm

## Board
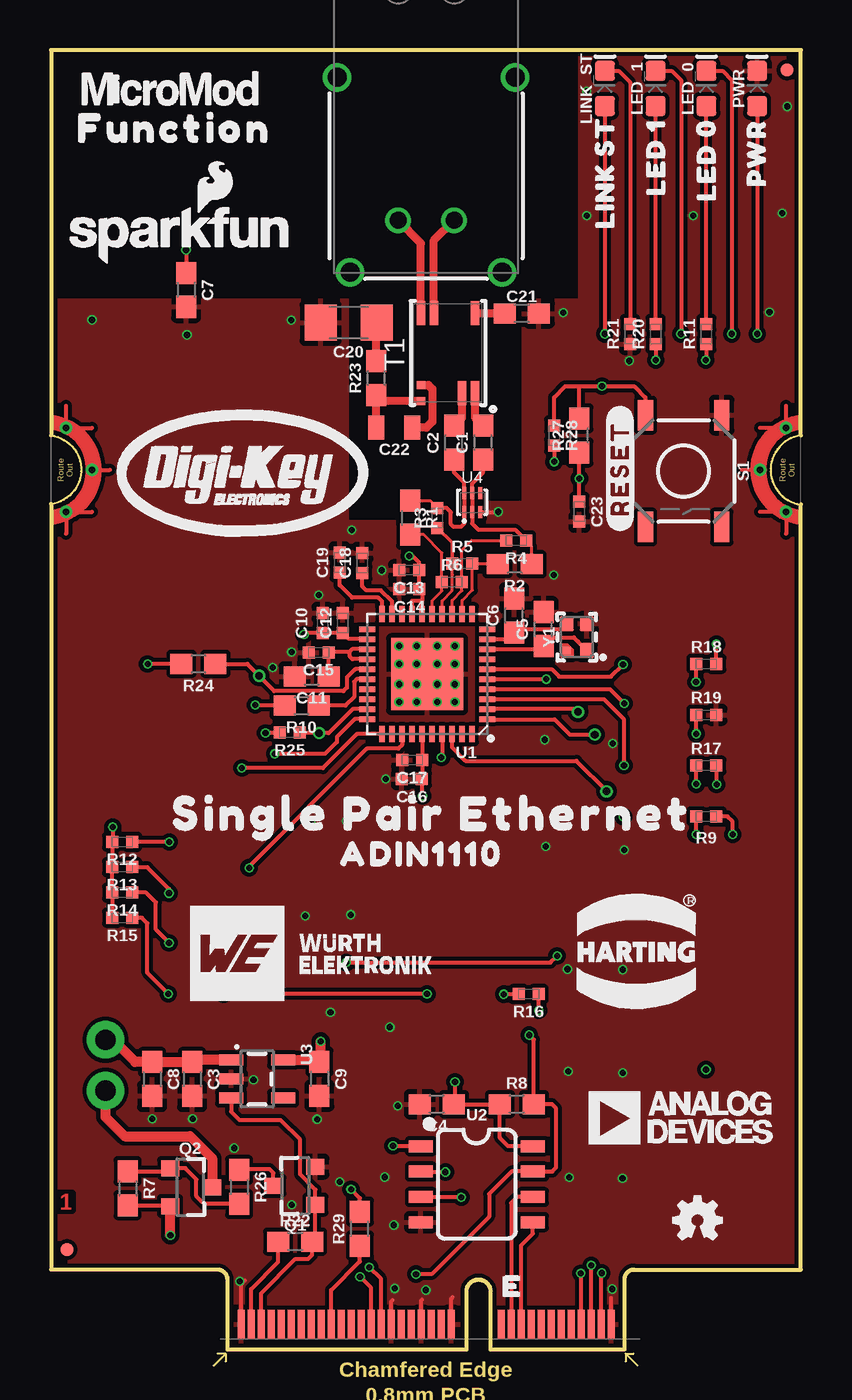
[diagram p1: board, top side]
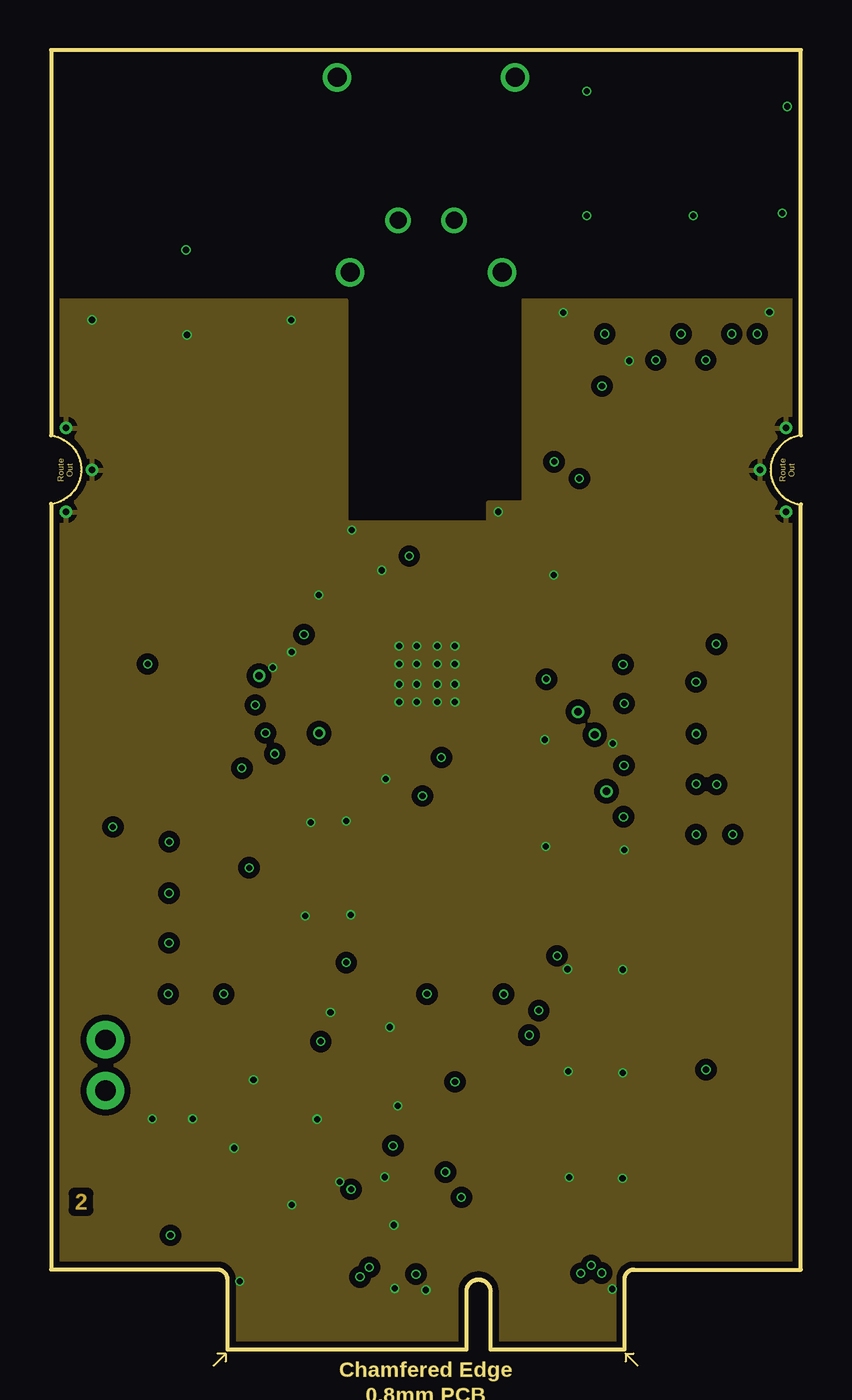
[diagram p2: board, inner layer Route2]
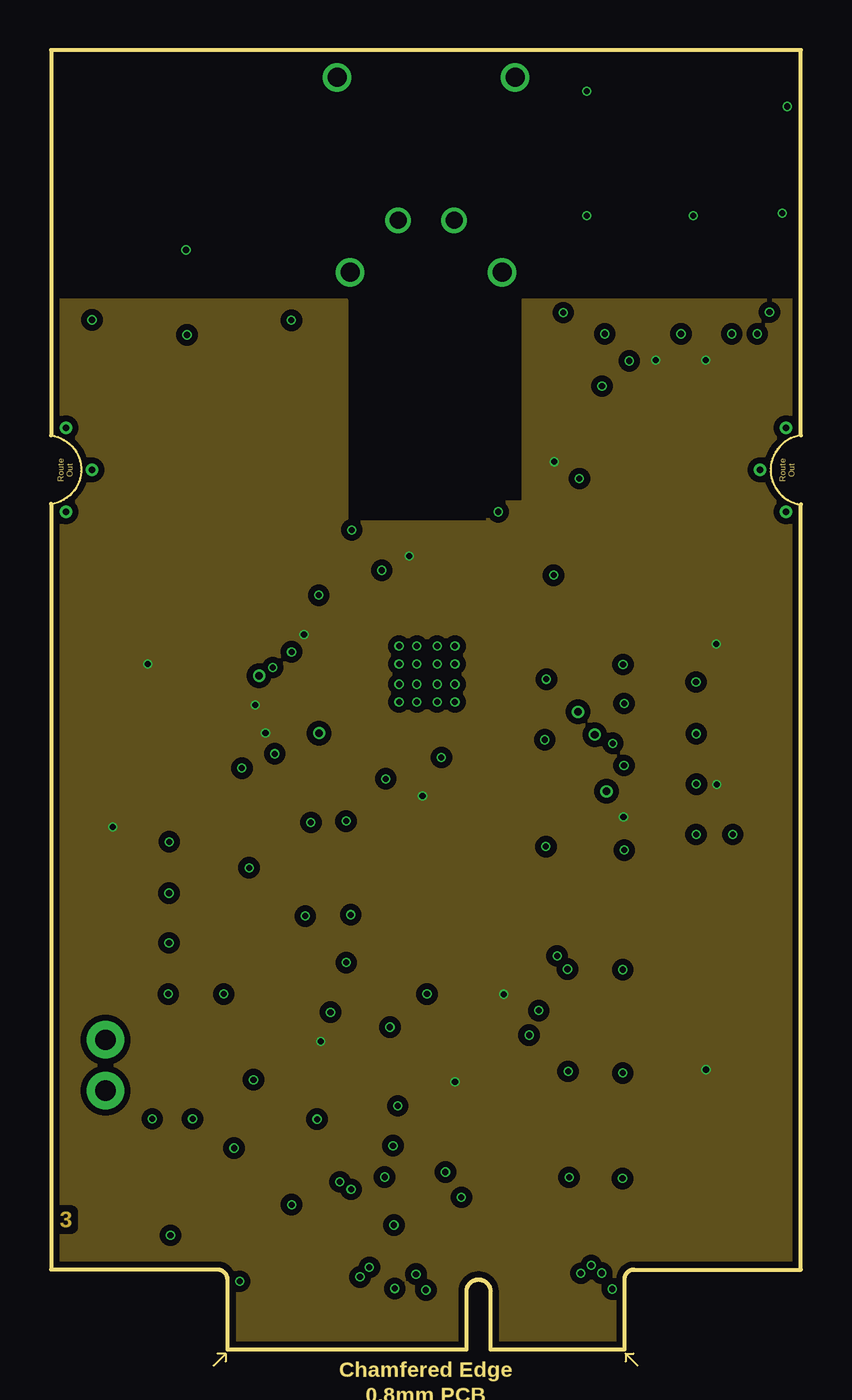
[diagram p3: board, inner layer Route15]
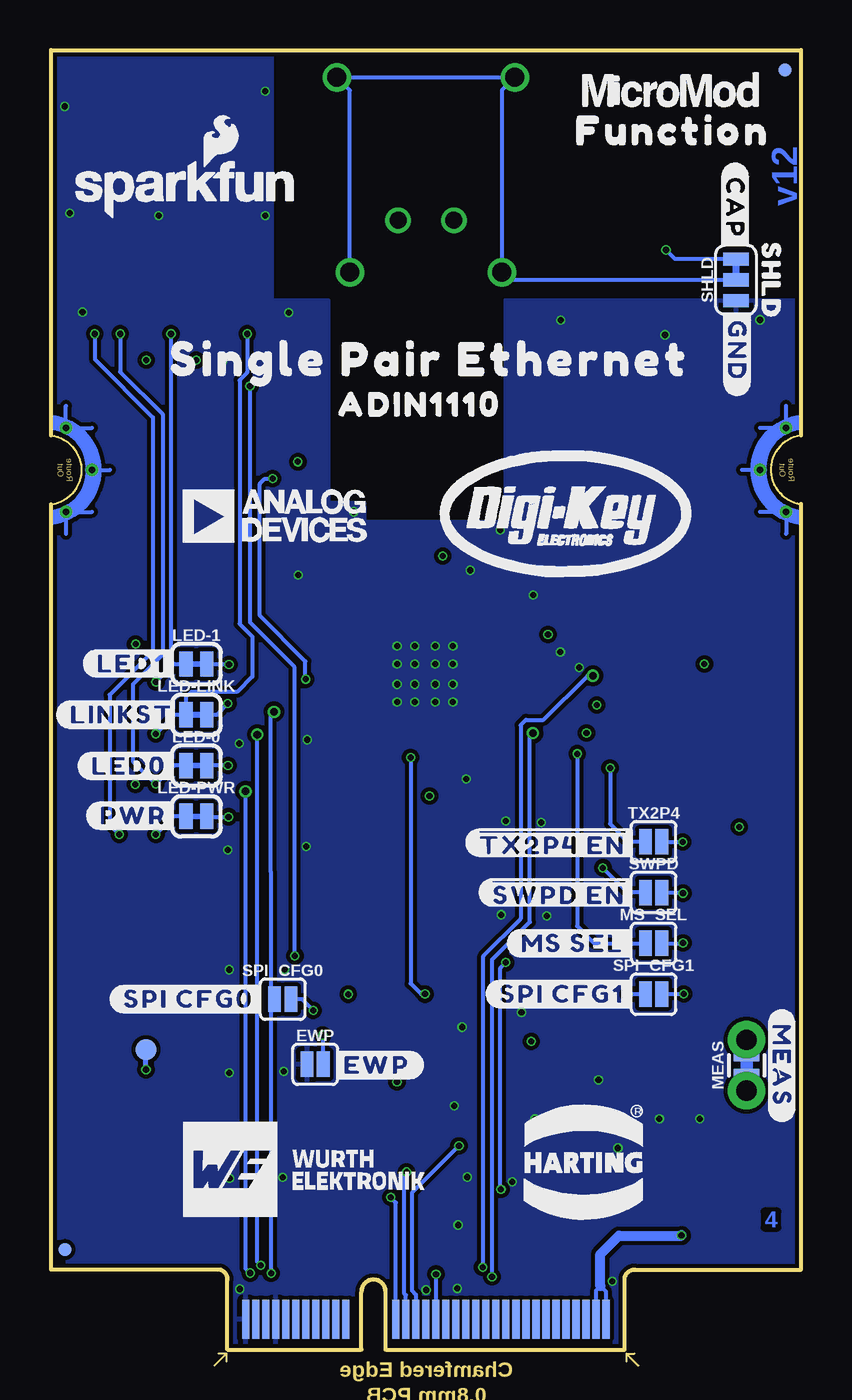
[diagram p4: board, bottom side, seen from below]

Size 37.5 x 65 mm. Coordinates in mm from the lower left corner, seen from the top.
Outline: 28.67,0 21.97,0 21.97,2.9 arc180 20.77,2.9 20.77,0 8.82,0 8.82,3.5 arc90 8.3,4 0,4 0,42.29 arc165 0,45.72 0,65 37.49,65 37.49,45.72 arc165 37.49,42.27 37.49,4 29.15,4 arc90 28.67,3.5 28.67,0
Copper layers (1+2*15+16): Top/Horz 0.035mm / dielectric 1.5mm / Route2 0.035mm / dielectric 0.15mm / Route15 0.035mm / dielectric 0.2mm / Bottom/Vert 0.035mm
Design rules "SparkFun-4-Layer-MicroMod-JLCPCB": minimum track width 4mil, minimum drill 0.2mm, track to track 4mil, track to pad 4mil, pad to pad 4mil, via to via 4mil, smd to smd 4mil, copper to edge 6mil, drill to drill 6mil, minimum pad ring 3mil, minimum via ring 3mil, stop-mask expansion 2.5mil, vias tented up to drill 25mil, thermal gap 10mil

### Footprints (pad centres in the part's own frame; a part is rotated, then mirrored left to right if it is on the bottom)
0603 = smd 1.1 x 1: 1 -0.85,0; 2 0.85,0
0402-TIGHT = smd 0.6 x 0.6: 1 -0.5,0; 2 0.5,0
1206 = smd 1.6 x 1.8: 1 -1.4,0; 2 1.4,0
0805 = smd 0.8 x 1.2: 1 -0.9,0; 2 0.9,0
TP_15TH = drill 0.381 pad 0.61: 1 0,0
SMT-JUMPER_2_NO_SILK = smd 0.635 x 1.27: 1 -0.406,0; 2 0.406,0
FIDUCIAL-MICRO = smd 0.635 x 0.635: 1 0,0
T1_INDUSTRIAL_JACK_AH_IP20 = drill 0.85 pad 1.25: 1 1.4,8.52; 2 -1.4,8.52 | drill 0.95 pad 1.35: S1 -3.8,11.12; S2 3.8,11.12; S3 4.45,1.37; S4 -4.45,1.37
M.2-CARD-E-22_FUNCTION_STANDARD = smd 0.35 x 1.45: 1 9.25,1.275; 3 8.75,1.275; 5 8.25,1.275; 7 7.75,1.275; 9 7.25,1.275; 11 6.75,1.275; 13 6.25,1.275; 15 5.75,1.275; 17 5.25,1.275; 19 4.75,1.275; 21 4.25,1.275; 23 3.75,1.275; 33 1.25,1.275; 35 0.75,1.275; 37 0.25,1.275; 39 -0.25,1.275; 41 -0.75,1.275; 43 -1.25,1.275; 45 -1.75,1.275; 47 -2.25,1.275; 49 -2.75,1.275; 51 -3.25,1.275; 53 -3.75,1.275; 55 -4.25,1.275; 57 -4.75,1.275; 59 -5.25,1.275; 61 -5.75,1.275; 63 -6.25,1.275; 65 -6.75,1.275; 67 -7.25,1.275; 69 -7.75,1.275; 71 -8.25,1.275; 73 -8.75,1.275; 75 -9.25,1.275 | smd 0.35 x 1.95 bottom: 2 9,1.525; 4 8.5,1.525; 6 8,1.525; 8 7.5,1.525; 10 7,1.525; 12 6.5,1.525; 14 6,1.525; 16 5.5,1.525; 18 5,1.525; 20 4.5,1.525; 22 4,1.525; 32 1.5,1.525; 34 1,1.525; 36 0.5,1.525; 38 0,1.525; 40 -0.5,1.525; 42 -1,1.525; 44 -1.5,1.525; 46 -2,1.525; 48 -2.5,1.525; 50 -3,1.525; 52 -3.5,1.525; 54 -4,1.525; 56 -4.5,1.525; 58 -5,1.525; 60 -5.5,1.525; 62 -6,1.525; 64 -6.5,1.525; 66 -7,1.525; 68 -7.5,1.525; 70 -8,1.525; 72 -8.5,1.525; 74 -9,1.525 | drill 0.305 pad 0.61: GND1 -18,41.9; GND2 -16.7,44; GND3 -18,46.1; GND4 18,41.9; GND5 16.7,44; GND6 18,46.1
SMT-JUMPER_2_NC_TRACE_SILK = smd 0.66 x 1.27: 1 -0.521,0; 2 0.521,0
LED-0603 = smd 1 x 1: A -0.877,0; C 0.877,0
COMBO-JUMPER_2_NC_TRACE = smd 0.635 x 1.27: 1 -0.508,0; 2 0.508,0 | drill 1.016 pad 1.88: 3 -1.27,0; 4 1.27,0
SOT23-3 = smd 0.8 x 0.9: 1 -0.95,-1; 2 0.95,-1; 3 0,1.1
TACTILE_SWITCH_SMD_5.2MM = smd 1.524 x 0.762: 1 -2.794,1.905; 2 2.794,1.905; 3 -2.794,-1.905; 4 2.794,-1.905
SMT-JUMPER_3_1-NC_TRACE_SILK = smd 0.66 x 1.27: 1 -1.041,0; 2 0,0; 3 1.041,0
WE_STST_TRANSFORMER_1:1_SMD_3.2X4.7MM_74930030 = smd 1.2 x 0.41: 1 -1.99,-1.35; 2 -1.99,-0.7; 5 1.99,-1.35; 6 1.99,0.7; 7 1.99,1.35 | smd 0.4 x 0.41: 3 -2.39,1.35; 4 -1.59,1.35
PAD.03X.04 = smd 1.016 x 1.016: 1 0,0
LFCSP-40 = smd 0.8 x 0.285: 1 -3,2.25; 2 -3,1.75; 3 -3,1.25; 4 -3,0.75; 5 -3,0.25; 6 -3,-0.25; 7 -3,-0.75; 8 -3,-1.25; 9 -3,-1.75; 10 -3,-2.25; 21 3,-2.25; 22 3,-1.75; 23 3,-1.25; 24 3,-0.75; 25 3,-0.25; 26 3,0.25; 27 3,0.75; 28 3,1.25; 29 3,1.75; 30 3,2.25 | smd 0.285 x 0.8: 11 -2.25,-3; 12 -1.75,-3; 13 -1.25,-3; 14 -0.75,-3; 15 -0.25,-3; 16 0.25,-3; 17 0.75,-3; 18 1.25,-3; 19 1.75,-3; 20 2.25,-3; 31 2.25,3; 32 1.75,3; 33 1.25,3; 34 0.75,3; 35 0.25,3; 36 -0.25,3; 37 -0.75,3; 38 -1.25,3; 39 -1.75,3; 40 -2.25,3 | smd 3.6 x 3.6: EP 0,0
SO08 = smd 0.6 x 1.2: 1 -1.905,-2.8; 2 -0.635,-2.8; 3 0.635,-2.8; 4 1.905,-2.8; 5 1.905,2.8; 6 0.635,2.8; 7 -0.635,2.8; 8 -1.905,2.8
SOT23-5 = smd 0.55 x 1.2: 1 -0.95,-1.3; 2 0,-1.3; 3 0.95,-1.3; 4 0.95,1.3; 5 -0.95,1.3
WE_TVS_1.0X1.2MM = smd 0.2 x 0.6: 1 -0.4,-0.475; 2 0,-0.475; 3 0.4,-0.475; 4 0.4,0.475; 5 0,0.475; 6 -0.4,0.475
CRYSTAL-SMD-2.0X1.6MM-WE = smd 0.75 x 0.7: 1 -0.675,-0.5; 2 0.675,-0.5; 3 0.675,0.5 | smd 0.381 x 0.381: 4 -0.675,0.5

### Placement (x,y rotation side)
C1  21.61,45.36 90 top
C2  20.15,45.36 90 top
C3  7.05,13.53 270 top
C4  19.29,12.27 180 top
C5  24.62,36.03 90 top
C6  23.15,36.72 90 top
C7  6.75,53 270 top
C8  5.05,13.53 270 top
C9  13.41,13.54 270 top
C10  13.58,36.35 90 top
C11  13.03,33.67 180 top
C12  14.6,36.34 90 top
C13  17.91,38.99 180 top
C14  17.92,38.03 180 top
C15  13.38,34.87 180 top
C16  18.04,28.53 180 top
C17  18.06,29.49 180 top
C18  15.57,39.35 90 top
C19  14.43,39.37 90 top
C20  14.88,51.36 180 top
C21  23.54,51.82 0 top
C22  17.17,46.1 180 top
C23  26.42,41.91 270 top
CIPO  26.34,31.89 0 top
COPI  27.18,30.76 0 top
CS  13.4,30.83 0 top
EWP  24.29,14.27 0 bottom
FD1  0.8,5 90 top
FD2  36.8,64 90 top
FD3  36.8,5 270 bottom
FD4  0.8,64 270 bottom
FRAME1  -6.97,-14.77 0 top  (outside the outline)
INT  10.4,33.7 0 top
J1  18.75,65 180 top
J2  18.75,0 0 top
LED-0  30.23,29.21 0 bottom
LED-1  30.23,34.29 0 bottom
LED-LINK  30.23,31.75 0 bottom
LED-PWR  30.23,26.67 0 bottom
LED_0  32.77,63.08 90 top
LED_1  30.23,63.08 90 top
LINK_ST  27.69,63.08 90 top
LOGO1  30.73,58.04 0 bottom
LOGO2  45.47,60.96 0 top  (outside the outline)
LOGO3  32.32,6.48 0 top
MEAS  2.72,14.22 90 bottom
MS_SEL  7.37,20.32 0 bottom
PWR  35.31,63.08 90 top
Q1  12.21,8.2 90 top
Q2  6.96,8.12 270 top
R1  17.95,41.6 270 top
R2  23.18,39.28 180 top
R3  19.32,41.6 90 top
R4  23.25,40.46 180 top
R5  20.56,39.31 0 top
R6  20.04,38.39 0 top
R7  3.83,8.06 270 top
R8  23.29,12.27 0 top
R9  32.77,26.67 180 top
R10  12.52,32.2 180 top
R11  32.77,50.8 90 top
R12  3.56,25.4 180 top
R13  3.56,24.13 180 top
R14  3.56,22.86 180 top
R15  3.56,21.59 180 top
R16  23.88,17.78 180 top
R17  32.77,29.21 0 top
R18  32.77,34.29 0 top
R19  32.77,31.75 0 top
R20  30.23,50.8 90 top
R21  28.96,50.8 90 top
R22  12.21,5.4 0 top
R23  16.27,48.6 90 top
R24  7.37,34.29 180 top
R25  11.94,30.86 180 top
R26  9.4,8.13 270 top
R27  26.42,45.72 90 top
R28  25.15,45.72 270 top
R29  15.44,6.04 90 top
S1  31.62,43.94 270 top
SHLD  3.25,53.5 90 bottom
SPI  27.77,27.92 0 top
SPI_CFG0  25.91,17.53 0 bottom
SPI_CFG1  7.37,17.78 0 bottom
SWPD  7.37,22.86 0 bottom
T1  19.85,49.84 90 top
TP1  32.75,15 0 bottom
TX2P4  7.37,25.4 0 bottom
U1  18.8,33.78 180 top
U2  21.29,8.27 270 top
U3  10.3,13.53 270 top
U4  21.05,42.37 0 top
U$1  [#RESET#0]  28.45,44.07 90 top
U$2  29.34,19.81 0 top
U$4  [ADIN11100]  18.54,24.79 0 top
U$5  9.27,43.94 0 top
U$6  [#PWR#19]  33.38,26.7 0 bottom
U$7  [PWR0]  35.28,59.85 90 top
U$8  [SHLD11]  1.5,53.45 270 bottom
U$9  [#EWP#18]  21.21,14.22 0 bottom
U$10  [#LED0#20]  33.59,29.19 0 bottom
U$11  [#GND#16]  3.2,49.95 270 bottom
U$12  [#CAP#17]  3.3,57.1 270 bottom
U$13  [##TX2P4_EN##4]  12.42,25.35 0 bottom
U$14  [#SPI_CFG1#0]  11.94,17.78 0 bottom
U$15  [#MS_SEL#2]  11.43,20.32 0 bottom
U$16  [#SPI_CFG0#0]  30.61,17.53 0 bottom
U$17  [SINGLE_PAIR_ETHERNET0]  19.05,26.8 0 top
U$18  [SINGLE_PAIR_ETHERNET0]  18.54,49.53 0 bottom
U$19  12.32,19.94 0 top
U$20  [ANALOG_DEVICE_LOGO_9MM]  26.16,41.53 0 bottom
U$21  [ADIN11100]  19.05,47.27 0 bottom
U$22  [##SWPD_EN##4]  12.1,22.86 0 bottom
U$23  [LED_03]  32.77,59.52 90 top
U$24  [FUNCTION0]  6.42,60.96 0 bottom
U$25  [LED_14]  30.23,59.65 90 top
U$26  [FUNCTION0]  6.15,61.09 0 top
U$27  [LINK_ST15]  27.69,58.89 90 top
U$28  [#MEAS#3]  0.96,16.99 270 bottom
U$29  [#LED1#21]  33.46,34.31 0 bottom
U$30  [HARTING_LOGO_9MM]  10.8,9.27 0 bottom
U$31  [#LINKST#2]  33.91,31.75 0 bottom
U$32  [WURTH_LOGO_9MM]  25.53,9.14 0 bottom
U$33  31.62,11.43 0 top
U$34  [DIGIKEY_LOGO]  12.07,41.91 0 bottom
U$35  [SFE_LOGO_NAME_FLAME_.1]  6.48,55.75 0 top
U$37  [MICROMOD_LOGO_.35]  6.57,62.97 0 bottom
U$63  [MICROMOD_LOGO_.35]  5.9,63.04 0 top
Y1  26.29,35.63 90 top

### Tracks (layer width: path | path; a pad name or v marks a point on that pad's centre or on a via)
1.1V
  Top/Horz 0.203: U1.23 15.06,35.03 14.94,34.91 | 14.94,34.91 14.94,34.66 15.07,34.53 U1.24 | C11.1 C15.1 13.92,34.91 14.94,34.91
3.3V  (via drill 0.3)
  Top/Horz 0.203: v3.09,26.14 3.09,25.4 R12.2 R13.2 R14.2 R15.2 | v17.91,39.69 18.09,39.69 18.41,39.37 C13.1 | U1.16 18.55,37.45 | 18.55,38.99 C13.1 | U1.22 14.9,35.54 C12.1 C10.1 12.73,35.85 v12.65,35.77 | v18.57,27.68 18.53,27.73 18.54,27.74 C16.1 18.55,28.55 C17.1 U1.35 | v10.21,32.24 11.64,32.24 R10.2 | v20.2,13.39 20.2,12.33 C4.1 R8.1 22.44,10.6 22.86,10.18 U2.8 | U1.17 18.05,37.45 18.55,37.45 | R17.2 33.27,28.27 v33.28,28.26 | R18.2 v33.27,35.28 | v33.27,35.28 | R11.1 32.77,49.52 v32.73,49.48 | R20.1 v30.23,49.49 v30.23,49.48 | R24.2 v4.83,34.29 | R25.2 11.42,30.84 v10.72,30.84 | R28.2 v25.15,44.4 | C13.1 18.42,38.98 C14.1 18.55,37.9 18.55,37.45 | R16.2 v22.63,17.77
  Top/Horz 0.508: U3.5 13.32,14.48 C9.1 13.48,14.46 v13.48,15.41 | v13.48,15.41
  Bottom/Vert 0.203: LED-PWR.2 29.68,26.64 v28.62,26.64
  Bottom/Vert 0.254: v32.75,14 TP1.1
  pour Route15 (isolate 0.305): -0.25,0 -0.25,52.5 14.75,52.5 14.75,41.4 21.87,41.4 21.87,42.38 23.63,42.38 23.63,52.5 37.75,52.5 37.75,0
3.3V_IN
  Top/Horz 0.203: J2.73 10,3.02 11.36,4.38 R22.1
!CS!  (via drill 0.3)
  Top/Horz 0.203: U1.29 15.08,32.03 13.88,30.83 CS.1 13.37,30.86 R25.1 | v15.45,3.63 16,3.08 J2.49
  Bottom/Vert 0.203: v15.45,3.63 15.44,3.64 15.44,19.51 13.56,21.39 13.56,30.68 CS.1
!INT!  (via drill 0.3)
  Top/Horz 0.203: U1.25 15.21,34.03 14.8,33.61 14.8,33.11 14.62,32.93 11.15,32.93 10.4,33.68 INT.1 9.81,34.29 R24.1 | v15.92,4.12 16.5,3.53 J2.47
  Bottom/Vert 0.203: v15.92,4.12 15.88,4.15 15.88,19.68 14.01,21.54 14.01,31.23 13.75,31.5 12.87,31.5 10.67,33.7 INT.1
!RESET!
  Top/Horz 0.203: J2.57 14,2.97 15.44,4.41 R29.1
!SWPD_EN!  (via drill 0.3)
  Top/Horz 0.203: U1.33 17.55,30.24 17.37,30.06 15.79,30.06 9.9,24.17 v9.9,24.09
  Bottom/Vert 0.203: v9.9,24.09 8.67,22.86 SWPD.1
!TX2P4_EN!  (via drill 0.3)
  Top/Horz 0.203: v9.54,29.08 13.59,29.08 15.29,30.78 U1.31
  Bottom/Vert 0.203: v9.54,29.08 9.54,26.29 8.65,25.4 TX2P4.1
A0  (via drill 0.3)
  Top/Horz 0.203: U2.1 17.12,10.18 v17.1,10.19
  Bottom/Vert 0.203: v17.1,10.19 19.46,7.83 19.46,2.96 19.25,2.75 J2.36
A1  (via drill 0.3)
  Top/Horz 0.203: v19.72,8.88 18.52,8.88 U2.2
  Bottom/Vert 0.203: J2.34 19.75,2.71 19.86,2.83 19.86,8.74 v19.72,8.88
A2  (via drill 0.3)
  Top/Horz 0.203: v20.51,7.62 18.51,7.62 U2.3
  Bottom/Vert 0.203: J2.32 20.25,7.35 v20.51,7.62
DA+
  Top/Horz 0.406: J1.1 18.5,55.33 T1.7
DA-
  Top/Horz 0.406: J1.2 19.15,55.48 T1.6
EWP  (via drill 0.3)
  Top/Horz 0.203: v18.25,3.77 19.03,3.77 21.91,6.64 21.91,7.78 23.03,8.9 U2.7 25.06,8.9 25.26,9.1 25.26,12.06 25.05,12.27 R8.2 24.14,15.49 v23.91,15.72
  Bottom/Vert 0.203: v18.25,3.77 J2.40 | v23.91,15.72 23.91,14.29 EWP.2
GND  (via drill 0.3)
  Top/Horz 0.203: J2.1 28,2.58 | J2.33 20,2.54 20.08,2.62 | J2.39 18.5,2.45 18.55,2.5 | J2.45 17,2.4 17.06,2.46 | J2.75 9.5,3.26 9.69,3.45 | U1.EP v19.3,33.27 | U4.3 v22.36,41.9
  other vias: 25.13,38.73 17.4,35.18 18.29,35.18 19.3,35.18 20.19,35.18 17.4,34.29 18.29,34.29 19.3,34.29 20.19,34.29 17.4,33.27 18.29,33.27 20.19,33.27 17.4,32.38 18.29,32.38 19.3,32.38 20.19,32.38 11.09,34.11 12.03,34.89 13.38,37.73 15.03,41 16.54,38.98 16.74,28.54 17.34,12.19 13.3,11.52 17.14,6.22 7.07,11.54 5.06,11.54 9.15,10.07 10.12,13.5 12.02,51.48 35.92,51.89 6.8,50.75 2.05,51.5 28.91,49.45 25.61,51.86 17.18,3.05 28.06,3.02 9.43,3.41 18.74,2.97 28.59,19 28.59,13.83 28.57,8.55 25.9,8.61 25.85,13.91 25.82,19.02 28.66,24.98 24.74,25.15 16.68,8.62 14.44,8.39 16.94,16.12 13.97,16.87 14.99,21.75 12.71,21.68 14.75,26.43 12.99,26.36 28.09,30.32 24.68,30.5 36.81,62.18 26.78,62.94 36.56,56.84 26.78,56.72 32.11,56.72 12.03,7.25
  pour Top/Horz (isolate 0.203): -0.25,0 -0.25,52.5 14.79,52.5 14.79,41.41 21.84,41.41 21.84,42.36 23.64,42.36 23.64,52.5 26.45,52.5 26.45,65 37.75,65 37.75,0
  pour Bottom/Vert (isolate 0.203): -0.25,0 37.75,0 37.75,65 26.45,65 26.45,52.5 23.64,52.5 23.64,42.37 21.84,42.37 21.84,41.41 14.77,41.41 14.77,52.5 -0.25,52.5
  pour Route2 (isolate 0.305): -0.25,0 -0.25,52.5 14.75,52.5 14.75,41.4 21.87,41.4 21.87,42.38 23.63,42.38 23.63,52.5 37.75,52.5 37.75,0
I2C_SCL
  Top/Horz 0.203: U2.6 23.3,7.63 23,7.33 J2.21
I2C_SDA
  Top/Horz 0.203: J2.19 23.5,5.21 24.09,5.8 U2.5
LED_0  (via drill 0.3)
  Top/Horz 0.203: U1.3 27.62,32.53 28.65,31.51 v28.65,29.21
  Bottom/Vert 0.203: v28.65,29.21 LED-0.2
LED_1  (via drill 0.3)
  Top/Horz 0.203: U1.6 25.02,34.03 25.4,33.66 27.99,33.66 v28.6,34.26
  Bottom/Vert 0.203: v28.6,34.26 29.68,34.26 LED-1.2
LINK_ST  (via drill 0.3)
  Top/Horz 0.203: U1.4 27.94,33.03 v28.65,32.32
  Bottom/Vert 0.203: v28.65,32.32 28.65,32.3 29.2,31.75 LED-LINK.2
MS_SEL  (via drill 0.3)
  Top/Horz 0.203: U1.30 15.19,31.53 14.29,30.63 14.29,30.39 13.7,29.8 v11.19,29.8
  Bottom/Vert 0.203: v11.19,29.8 11.19,21.18 10.33,20.32 MS_SEL.1
N$1
  Top/Horz 0.508: MEAS.3 2.72,11.63 3.68,10.67 6.96,10.67 8.06,9.57 Q2.3
  Bottom/Vert 0.203: MEAS.1 MEAS.3
N$2
  Top/Horz 0.508: MEAS.4 3.1,15.49 4.21,14.38 C8.1 C3.1 7.15,14.48 U3.1
  Bottom/Vert 0.203: MEAS.2 MEAS.4
N$3
  Top/Horz 0.406: C21.1 T1.5
N$4
  Top/Horz 0.406: T1.4 18.86,48.25 19.06,48.04 19.06,46.4 18.77,46.1 C22.1
N$5  (via drill 0.3)
  Top/Horz 0.203: v32.26,30.8 R19.1 | LINK_ST.A v27.69,50.8 | v27.69,50.8
  Bottom/Vert 0.203: v32.26,30.8 31.31,31.75 LED-LINK.1 30.75,32.63 30.48,32.89 28.2,32.89 27.43,33.66 27.43,35.66 28.07,36.29 28.07,48.48 27.69,48.87 v27.69,50.8
N$6  (via drill 0.3)
  Top/Horz 0.203: LED_1.C 31.03,63.95 31.5,63.49 v31.5,50.8 | v32.25,33.39 32.25,34.27 R18.1
  Bottom/Vert 0.203: 31.35,34.29 31.5,34.29 v31.5,50.8 | 31.35,34.29 LED-1.1 | 31.35,34.29 v32.25,33.39
N$7
  Top/Horz 0.406: T1.3 16.57,47.45 R23.1 C22.2
N$8
  Top/Horz 0.203: C20.1
  Top/Horz 0.406: R23.2 C20.1
N$9  (via drill 0.3)
  Top/Horz 0.203: v32.26,28.28 R17.1 | LED_0.C 33.58,63.95 34.04,63.5 v34.04,50.8
  Bottom/Vert 0.203: LED-0.1 31.33,29.21 v32.26,28.28 33.4,29.42 33.4,33.27 31.92,34.76 31.92,46.78 34.04,48.9 v34.04,50.8
N$10
  Top/Horz 0.203: Q1.3 11.11,8.83 10.92,9.02 9.44,9.02 R26.1
N$11
  Top/Horz 0.203: R7.1 5.8,8.91 Q2.1 6.71,9.07 7.27,8.51 7.27,7.67 7.6,7.34 7.66,7.28 R26.2
N$12
  Top/Horz 0.203: Y1.1 26.34,35.4 26.34,35.42 26.14,35.62 25.06,35.62 C5.1 24.48,35.03 U1.8
N$13  (via drill 0.3)
  Top/Horz 0.203: U1.5 v24.76,33.53 v24.77,33.53 | R27.1 v26.42,43.56 C23.1
  Bottom/Vert 0.203: v24.77,33.53 v24.77,33.54 24.77,34.42 27.05,36.7 27.05,43.31 26.8,43.56 v26.42,43.56
N$14
  Top/Horz 0.203: Y1.3 25.52,36.05 23.33,36.05 C6.1 22.82,35.53 U1.9
N$15  (via drill 0.3)
  Top/Horz 0.203: v14.76,19.36 24.97,19.36 v25.3,19.69 | R28.1 25.15,47.62 25.71,48.19 26.42,48.19 | 26.42,48.19 v27.55,48.19 29.16,48.19 29.72,47.62 S1.3 | R27.2 26.42,48.19 | R29.2 15.44,7.57 v15,8.01
  Bottom/Vert 0.203: v27.55,48.19 27.56,48.18 27.56,36.38 25.34,34.17 25.34,19.73 v25.3,19.69 | v15,8.01 15.03,8.04 15.03,19.08 v14.76,19.36
N$18
  Top/Horz 0.203: U1.26 15.29,33.53 15.15,33.39 15.15,32.63 14.72,32.2 R10.1
N$19  (via drill 0.3)
  Top/Horz 0.203: v32.25,25.77 32.25,26.65 R9.2
  Bottom/Vert 0.203: LED-PWR.1 31.35,26.67 v32.25,25.77
N$20  (via drill 0.3)
  Top/Horz 0.203: PWR.A v35.31,50.8 | v35.31,50.8 | v34.08,25.77 34.08,26.41 33.82,26.67 R9.1
  Bottom/Vert 0.203: v35.31,50.8 35.31,49.53 32.4,46.62 32.4,34.91 34.56,32.75 34.56,26.25 v34.08,25.77
N$21
  Top/Horz 0.203: U1.19 17.05,37.41 16.49,37.97 15.77,37.97 15.57,38.17 C18.1
N$22
  Top/Horz 0.203: U1.20 16.55,37.42 16.36,37.61 15.05,37.61 14.43,38.23 C19.1
N$23
  Top/Horz 0.203: R11.2 LED_0.A | LED_0.A
N$24
  Top/Horz 0.152: R2.1 24.03,40.18 R4.1
  Top/Horz 0.203: C1.1 21.61,43.87 21.05,43.31 U4.5 U4.2 21.05,41.31 21.36,41 23.21,41 R4.1
N$25  (via drill 0.3)
  Top/Horz 0.203: v5.9,20.34 5.24,21 5.24,22.36 4.74,22.86 R14.1
  Bottom/Vert 0.203: MS_SEL.2 5.91,20.32 v5.9,20.34
N$26  (via drill 0.3)
  Top/Horz 0.203: v5.9,22.82 5.9,23.05 4.82,24.12 R13.1
  Bottom/Vert 0.203: SWPD.2 5.93,22.86 v5.9,22.82
N$27  (via drill 0.3)
  Top/Horz 0.203: v5.91,25.39 v5.9,25.4 R12.1
  Bottom/Vert 0.203: TX2P4.2 v5.91,25.39
N$28  (via drill 0.3)
  Top/Horz 0.203: v24.39,16.96 v24.38,16.97 R16.1
  Bottom/Vert 0.203: SPI_CFG0.2 24.96,17.53 v24.39,16.96
N$29  (via drill 0.3)
  Top/Horz 0.203: v5.86,17.78 5.86,17.8 4.82,18.84 4.82,21.31 4.54,21.59 R15.1
  Bottom/Vert 0.203: SPI_CFG1.2 v5.87,17.78 v5.86,17.78
N$30
  Top/Horz 0.203: LED_1.A R20.2
N$31
  Top/Horz 0.152: R3.2 18.97,42.45 R1.1
  Top/Horz 0.203: C2.1 20.15,43.87 20.65,43.37 U4.6 U4.1 20.65,41.32 20.48,41.15 20.13,41.15 19.99,41.28 19.99,41.88 19.77,42.1 R3.2
N$32
  Top/Horz 0.406: T1.1 21.2,46.62 C1.2
N$33
  Top/Horz 0.203: LINK_ST.C 28.38,63.95 28.96,63.38 R21.2
N$34
  Top/Horz 0.406: T1.2 20.55,46.6 C2.2
N$35
  Top/Horz 0.152: U1.13 20.05,37.47 20.54,37.96 R6.2 20.54,39.99 21.02,40.47 R4.2
N$36
  Top/Horz 0.152: U1.14 19.55,37.44 20.06,37.95 20.06,38.76 R5.1
  Top/Horz 0.178: R5.1 20.06,40.36 R3.1
N$37
  Top/Horz 0.152: U1.15 19.05,37.45 19.54,37.94 R6.1 19.54,39.85 18.64,40.75 R1.2
N$38
  Top/Horz 0.152: U1.12 20.55,37.47 21.06,37.98 R5.2 22.31,39.31 R2.2
N$41  (via drill 0.3)
  Top/Horz 0.203: v6.75,55 C7.1
  Bottom/Vert 0.203: SHLD.3 6.29,54.54 v6.75,55
N$43
  Bottom/Vert 0.203: SHLD.2 14.57,53.5 J1.S2 14.95,62.98 J1.S3 J1.S4 22.55,62.98 J1.S1
PWR_EN
  Top/Horz 0.203: U3.3 9,11.9 9.42,11.47 11.48,11.47 12.45,10.51 12.45,8.76 13.21,8 Q1.1 13.21,5.55 R22.2 13.06,4.73 12.86,4.53 12.21,4.53 10.5,2.81 J2.71
SPI_CFG1  (via drill 0.3)
  Top/Horz 0.203: U1.37 19.55,29.64 v19.52,29.61 | v18.8,17.78 v8.64,17.78
  Bottom/Vert 0.203: v19.52,29.61 19.52,18.31 18.99,17.78 v18.8,17.78 | v8.64,17.78 SPI_CFG1.1
SPI_PICO  (via drill 0.3)
  Top/Horz 0.203: U1.1 25.18,31.52 25.94,30.76 COPI.1 | J2.5 27,4.21 v27.01,4.22
  Bottom/Vert 0.203: v27.01,4.22 27.19,4.39 COPI.1
SPI_POCI/SPI_CFG0  (via drill 0.3)
  Top/Horz 0.203: J2.7 v26.5,3.81 v26.49,3.81 | U1.2 26.2,32.04 CIPO.1
  Bottom/Vert 0.203: v26.49,3.81 26.49,17.7 | 26.49,17.7 26.49,23.87 26.5,23.87 26.5,31.74 CIPO.1 | SPI_CFG0.1 26.49,17.7
SPI_SCK  (via drill 0.3)
  Top/Horz 0.203: U1.38 20.05,30.12 20.72,29.45 26.26,29.45 27.77,27.93 SPI.1 | J2.3 27.5,3.79 v27.53,3.82
  Bottom/Vert 0.203: SPI.1 27.77,4.07 v27.53,3.82
VCC_IN  (via drill 0.3)
  Top/Horz 0.203: R7.2 5.92,7.21 Q2.2
  Top/Horz 0.508: v5.97,5.71 5.96,5.73 Q2.2
  Bottom/Vert 0.203: J2.74 9.75,2.89 10.03,3.17 10.25,2.96 J2.72
  Bottom/Vert 0.508: 10.03,3.17 10.03,4.76 9.1,5.69 5.97,5.69 v5.97,5.71

### Text on the board
Top/Horz: 1
Route2: 2
Route15: 3
Bottom/Vert: v12 | 4
Measures: UNITS IN INCHES
tDocu: Board Thickness is 0.8mm | 4-Layer | Beveled Edge | ENIG Finish | Pete Lewis | Based off the MicroMod PoE Ethernet / function board by N. Seidle